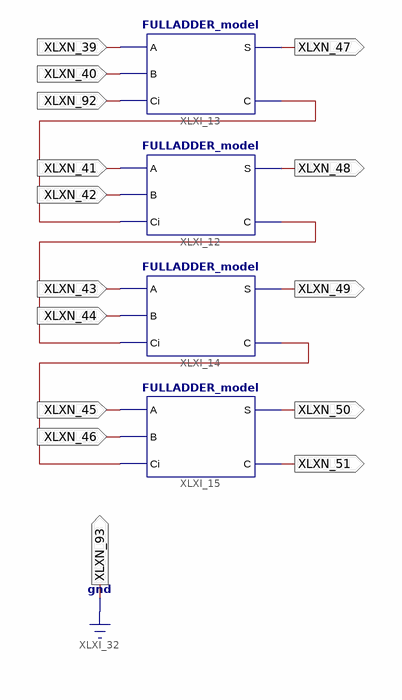
[diagram p0: schematic sheet 1]
// Xilinx ISE schematic week1schema.sch (spartan3e) as structural Verilog: 4 symbols, 15 ports
module week1schema (
  input  XLXN_39,
  input  XLXN_40,
  input  XLXN_41,
  input  XLXN_42,
  input  XLXN_43,
  input  XLXN_44,
  input  XLXN_45,
  input  XLXN_46,
  input  XLXN_92,
  output XLXN_47,
  output XLXN_48,
  output XLXN_49,
  output XLXN_50,
  output XLXN_51,
  output XLXN_93
);

  wire XLXN_35, XLXN_36, XLXN_37;

  FULLADDER_model XLXI_13 (.A(XLXN_39), .B(XLXN_40), .Ci(XLXN_92), .S(XLXN_47), .C(XLXN_35));
  FULLADDER_model XLXI_12 (.A(XLXN_41), .B(XLXN_42), .Ci(XLXN_35), .S(XLXN_48), .C(XLXN_36));
  FULLADDER_model XLXI_14 (.A(XLXN_43), .B(XLXN_44), .Ci(XLXN_36), .S(XLXN_49), .C(XLXN_37));
  FULLADDER_model XLXI_15 (.A(XLXN_45), .B(XLXN_46), .Ci(XLXN_37), .S(XLXN_50), .C(XLXN_51));

  assign XLXN_93 = 1'b0;

  // Notes on the sheet:
  //   LOC on signal XLXN_39 = P11
  //   LOC on signal XLXN_40 = G3
  //   LOC on signal XLXN_41 = L3
  //   LOC on signal XLXN_42 = F3
  //   LOC on signal XLXN_43 = K3
  //   LOC on signal XLXN_44 = E2
  //   LOC on signal XLXN_45 = B4
  //   LOC on signal XLXN_46 = N3
  //   LOC on signal XLXN_47 = M5
  //   LOC on signal XLXN_48 = M11
  //   LOC on signal XLXN_49 = P7
  //   LOC on signal XLXN_50 = P6
  //   LOC on signal XLXN_51 = N5
  //   LOC on signal XLXN_92 = A7
  //   LOC on signal XLXN_93 = G1
endmodule
